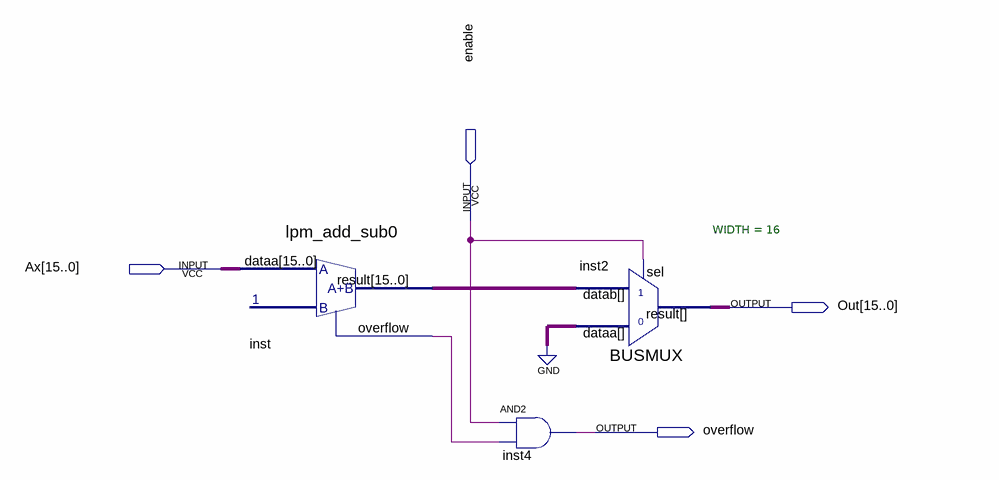
[diagram p0: schematic sheet]
// Quartus schematic ALU_INC.bdf as structural Verilog: 3 symbols, 4 pins
module ALU_INC (
  input  enable,
  input  [15:0] Ax,
  output [15:0] Out,
  output overflow
);

  wire inst_overflow;
  wire [15:0] inst_result;

  lpm_add_sub0 inst (.dataa(Ax), .result(inst_result), .overflow(inst_overflow));
  and inst4 (overflow, enable, inst_overflow);
  BUSMUX #(.WIDTH(16)) inst2 (.datab(inst_result), .sel(enable), .dataa({16{1'b0}}), .result(Out));
endmodule
